# EAGLE design SparkFun_Micro_Temperature_Sensor-STTS22H (EAGLE 9.6.2)
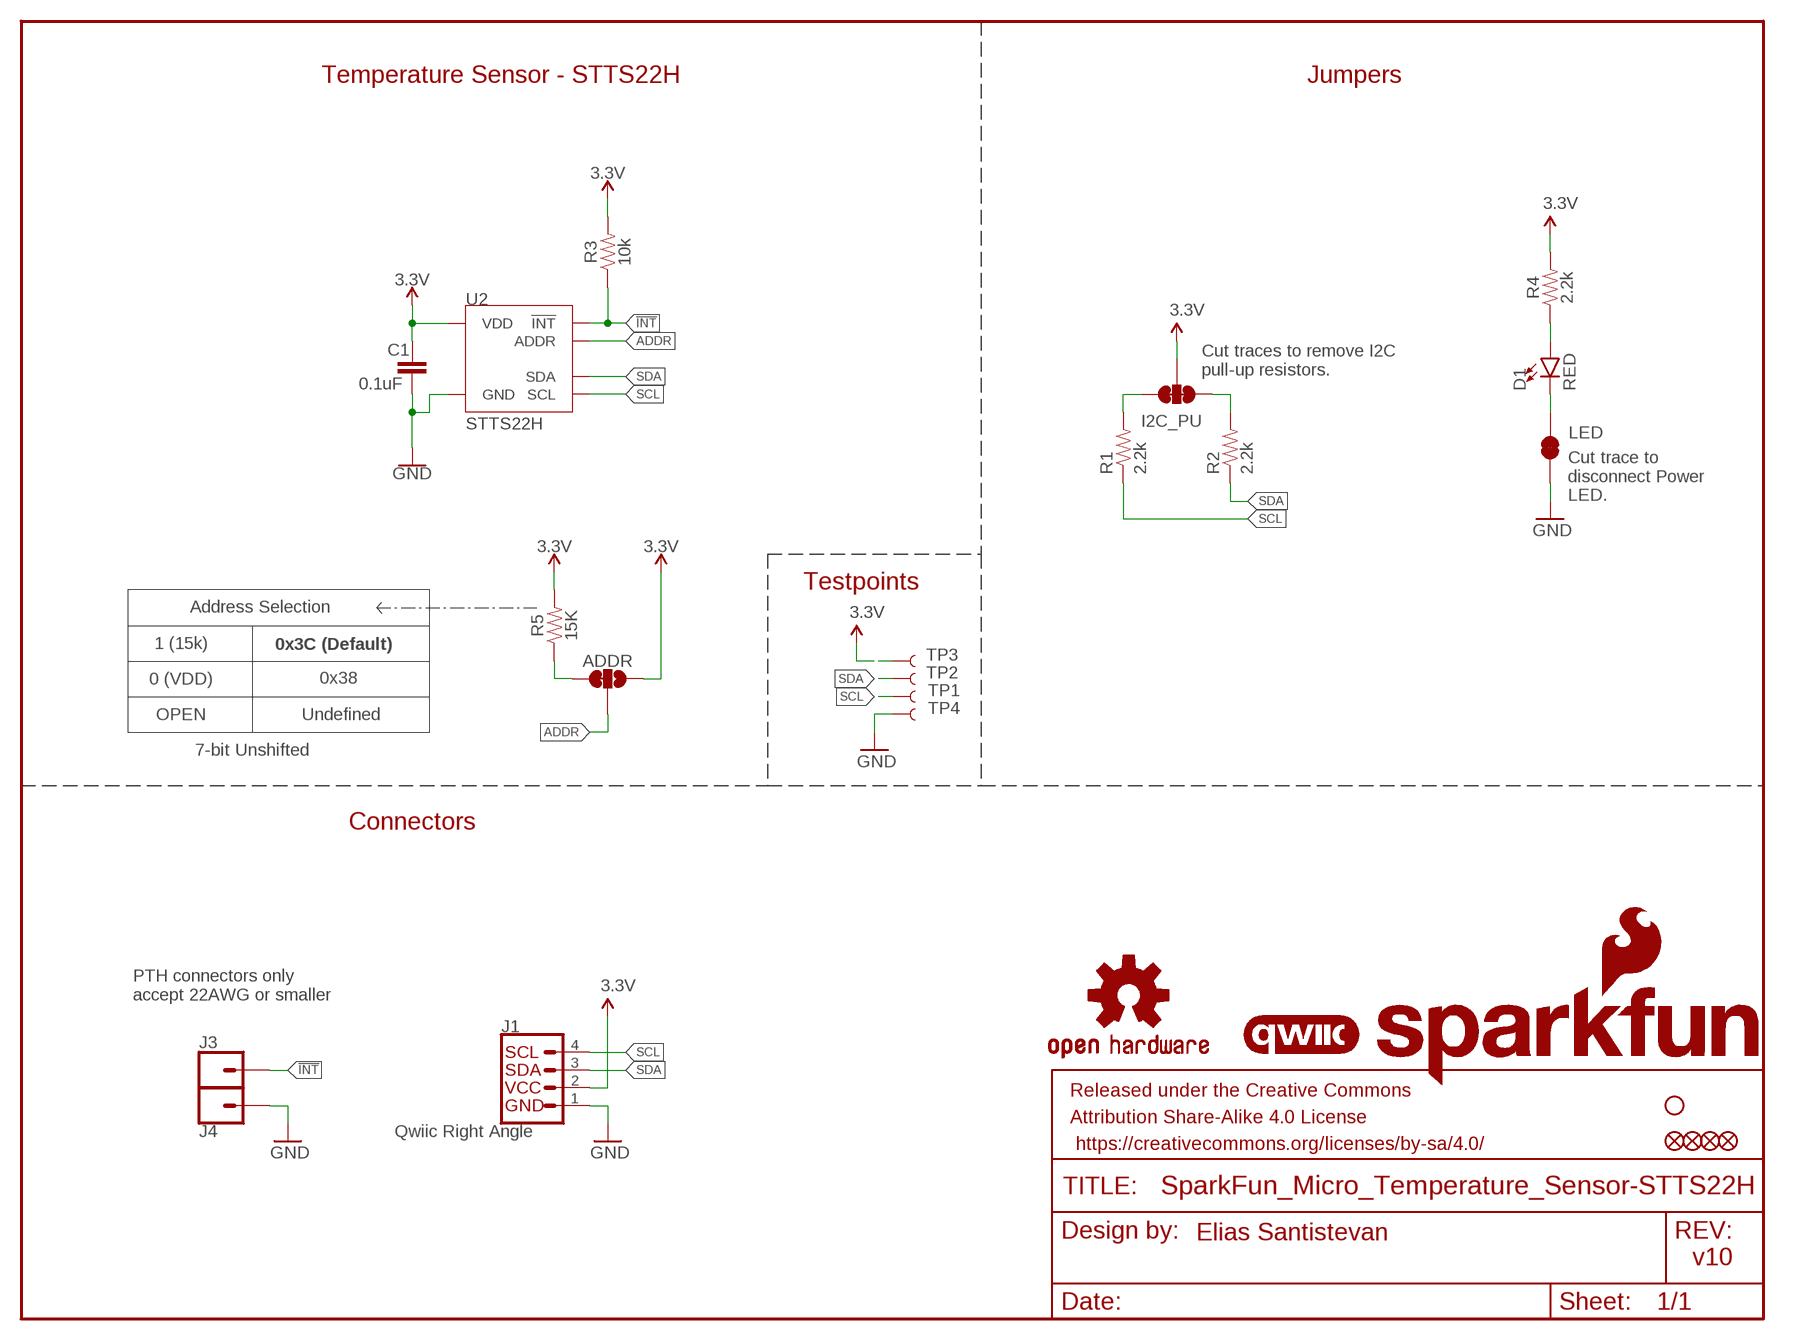
[diagram p0: schematic, sheet 1]

## Parts
ADDR  JUMPER-SMT_3_1-NC_TRACE_SILK  [SMT-JUMPER_3_1-NC_TRACE_SILK]
C1  0.1uF  0.1UF-0402T-16V-10%  [0402-TIGHT]
D1  RED  LED-RED_0402  [LED-0402]
FD1  FIDUCIALUFIDUCIAL  [FIDUCIAL-MICRO]
FD2  FIDUCIALUFIDUCIAL  [FIDUCIAL-MICRO]
FID1  FIDUCIALUFIDUCIAL  [FIDUCIAL-MICRO]
FID2  FIDUCIALUFIDUCIAL  [FIDUCIAL-MICRO]
FRAME1  FRAME-LETTER  [CREATIVE_COMMONS]
I2C_PU  S_MODE  JUMPER-SMT_3_2-NC_TRACE_SILK  [SMT-JUMPER_3_2-NC_TRACE_SILK]
J1  Qwiic Right Angle  I2C_STANDARDQWIIC  [JST04_1MM_RA]
J3  CONN_01_1MM  [1X01_1MM_NO_SILK]
J4  CONN_01_1MM  [1X01_1MM_NO_SILK]
LED  JUMPER-SMT_2_NC_TRACE_SILK  [SMT-JUMPER_2_NC_TRACE_SILK]
LOGO1  QWIIC_LOGO_3MM  [QWIIC_3MM]
LOGO2  OSHW-LOGOMINI  [OSHW-LOGO-MINI]
LOGO3  SFE_LOGO_NAME_FLAMEBLANK  [BLANK]
R1  2.2k  2.2KOHM-0402T-1/16W-1%  [0402-TIGHT]
R2  2.2k  2.2KOHM-0402T-1/16W-1%  [0402-TIGHT]
R3  10k  10KOHM-0402T-1/16W-1%  [0402-TIGHT]
R4  2.2k  2.2KOHM-0402T-1/16W-1%  [0402-TIGHT]
R5  15K  15KOHM-0402-TIGHT-1/16THW-1%  [0402-TIGHT]
STANDOFF1  STAND-OFFTIGHT  [STAND-OFF-TIGHT]
TP1  TEST-POINT3  [PAD.03X.03]
TP2  TEST-POINT3  [PAD.03X.03]
TP3  TEST-POINT3  [PAD.03X.03]
TP4  TEST-POINT3  [PAD.03X.03]
U2  STTS22H  [UDFN-6L]

## Nets
3.3V: ADDR.1 C1.1 I2C_PU.2 J1.2 R3.2 R4.2 R5.2 TP3.1 U2.P3(VDD)
!INT!: J3.1 R3.1 U2.P2(!INT!)
ADDR: ADDR.2 U2.P4(ADDR)
GND: C1.2 J1.1 J4.1 LED.1 TP4.1 U2.P5(GND) U2.P7(GND)
N$1: ADDR.3 R5.1
N$2: D1.A R4.1
N$3: D1.C LED.2
N$5: I2C_PU.1 R1.2
N$6: I2C_PU.3 R2.2
SCL: J1.4 R1.1 TP1.1 U2.P1(SCL)
SDA: J1.3 R2.1 TP2.1 U2.P6(SDA)

## Notes on the sheet
- Temperature Sensor - STTS22H | Jumpers
- Cut traces to remove I2C
  pull-up resistors.
- Cut trace to
  disconnect Power
  LED.
- Testpoints
- Address Selection
- 1 (15k)
- 0x3C (Default)
- 0 (VDD)
- 0x38
- OPEN | Undefined
- 7-bit Unshifted
- Connectors
- PTH connectors only 
  accept 22AWG or smaller
- Elias Santistevan
- v10

## Library data of the parts
ADDR = SparkFun-Jumpers:JUMPER-SMT_3_1-NC_TRACE: Normally closed trace jumper (1 of 2 connections) This jumper has a trace between two pads so it's normally closed (NC). The other connection is normally open (NO). Use a razor knife to open the connection. For best results follow the IPC guidelines for cutting traces: Cutout at least 0.063 mm (0.005 in). Remove all loose material to clean up the cut area. Seal the cut with an approved epoxy. Reapply solder to reclose the connection, or to close the NO connection.
C1 = SparkFun-Capacitors:0.1UF: 0.1µF ceramic capacitors A capacitor is a passive two-terminal electrical component used to store electrical energy temporarily in an electric field.; PROD_ID: CAP-12416
D1 = SparkFun-LED:LED-RED: Red SMD LED Used in manufacturing of most products at SparkFun Packages: 0603 - SMD 0603 package [Product Link] <http://docs.avagotech.com/docs/AV02-0551EN> 0603 SMART - SMD 0603 SMART package ( more efficient and expensive)[Product Link] <http://www.osram-os.com/Graphics/XPic2/00077099_0.pdf> 1206 - SMD1206 package [Product Link] <https://www.sparkfun.com/datasheets/DevTools/LilyPad/Q150OVS4.pdff> SparkFun Products: Pro Mini 328 -5V <https://www.sparkfun.com/products/821> RedBoard <https://www.sparkfun.com/products/12757> IOIO-OTG <https://www.sparkfun.com/products/13613>; PROD_ID: DIO-16757
FD1 FD2 FID1 FID2 = SparkFun-Aesthetics:FIDUCIAL: Fiducial Alignment Points Point-of-reference for pick-and-place machines and other optical instruments.
FRAME1 = SparkFun-Aesthetics:FRAME-LETTER: Schematic Frame - Letter Standard 8.5x11 US Letter frame; DESIGNER: Elias Santistevan
I2C_PU = SparkFun-Jumpers:JUMPER-SMT_3_2-NC_TRACE: Normally closed trace jumper (2 of 2 connections) This jumper has a trace between all three pads so they are normally closed (NC). Use a razor knife to open the connection(s). For best results follow the IPC guidelines for cutting traces: Cutout at least 0.063 mm (0.005 in). Remove all loose material to clean up the cut area. Seal the cut with an approved epoxy. Reapply solder to reclose the connection(s).
J1 = SparkFun-Connectors:I2C_STANDARD: SparkFun I2C Standard Pinout Header SparkFun has standardized on a pinout for all I2C based sensor breakouts. This pinout allows I2C boards to be plugged directly into the headers on Arduino Uno compatible boards, and to be daisy chained easily. Example SparkFun Products: SparkFun Atmospheric Sensor Breakout - BME280 <https://www.sparkfun.com/products/13676> SparkFun Altitude/Pressure Sensor Breakout - MPL3115A2 <https://www.sparkfun.com/products/11084> SparkFun TOF Range Finder Sensor - VL6180 <https://www.sparkfun.com/products/12785>; PROD_ID: CONN-13694
J3 J4 = SparkFun-Connectors:CONN_01: Single connection point. Often used as Generic Header-pin footprint for 0.1 inch spaced/style header connections On any of the 0.1 inch spaced packages, you can populate with these: Break Away Headers - Straight <https://www.sparkfun.com/products/116> (PRT-00116) Break Away Male Headers - Right Angle <https://www.sparkfun.com/products/553> (PRT-00553) Female Headers <https://www.sparkfun.com/products/115> (PRT-00115) Break Away Headers - Machine Pin <https://www.sparkfun.com/products/117> (PRT-00117) Break Away Female Headers - Swiss Machine Pin <https://www.sparkfun.com/products/743> (PRT-00743) This device is also useful as a general connection point to wire up your design to another part of your project. Our various solder wires solder well into these plated through hole pads. Hook-Up Wire - Assortment (Stranded, 22 AWG) <https://www.sparkfun.com/products/11375> (PRT-11375) Hook-Up Wire - Assortment (Solid Core, 22 AWG) <https://www.sparkfun.com/products/11367> (PRT-11367) View the entire wire category on our website here <https://www.sparkfun.com/categories/141> Special notes: SMTSO-256-ET is a "flush mount" nut for a 4-40 screw. We mostly use this on specialty testbeds; it is a nice way to connect hardware to your PCB at an adjustable hieght. Also note, the SNAP packages are for using a snappable style connector. We sell a baggie of snaps and they are also used on two LilyPad designs: Snap Assortment - 30 pack (male and female) <https://www.sparkfun.com/products/11347> (DEV-11347) LilyPad Arduino SimpleSnap <https://www.sparkfun.com/products/10941> (DEV-10941) LilyPad SimpleSnap Protoboard <https://www.sparkfun.com/products/10940> (DEV-10940)
LED = SparkFun-Jumpers:JUMPER-SMT_2_NC_TRACE: Normally closed trace jumper This jumper has a trace between two pads so it's normally closed (NC). Use a razor knife to open the connection. For best results follow the IPC guidelines for cutting traces: Cutout at least 0.063 mm (0.005 in). Remove all loose material to clean up the cut area. Seal the cut with an approved epoxy. Reapply solder to reclose the connection.
LOGO1 = SparkFun-Aesthetics:QWIIC_LOGO: Qwiic Logos for placement on schematic and PCB. The 5.5mm silk logo is best for placing next to Qwiic connector.
LOGO2 = SparkFun-Aesthetics:OSHW-LOGO: Open-Source Hardware (OSHW) Logo This logo indicates the piece of hardware it is found on incorporates a OSHW license and/or adheres to the definition of open source hardware found here: http://freedomdefined.org/OSHW
LOGO3 = SparkFun-Aesthetics:SFE_LOGO_NAME_FLAME: SparkFun Font Logo w/ Flame This is the SparkFun full logo. The logo on the schematic will always be the same size; the package variant is the height of the flame part of the logo. Default layer for the logo on the board is tSilk.
R1 R2 R4 = SparkFun-Resistors:2.2KOHM: 2.2kΩ resistor A resistor is a passive two-terminal electrical component that implements electrical resistance as a circuit element. Resistors act to reduce current flow, and, at the same time, act to lower voltage levels within circuits. - Wikipedia; PROD_ID: RES-14341
R3 = SparkFun-Resistors:10KOHM: 10kΩ resistor A resistor is a passive two-terminal electrical component that implements electrical resistance as a circuit element. Resistors act to reduce current flow, and, at the same time, act to lower voltage levels within circuits. - Wikipedia; PROD_ID: RES-14241
R5 = SparkFun-Resistors:15KOHM: 15kΩ resistor A resistor is a passive two-terminal electrical component that implements electrical resistance as a circuit element. Resistors act to reduce current flow, and, at the same time, act to lower voltage levels within circuits. - Wikipedia; PROD_ID: RES-15004
STANDOFF1 = SparkFun-Hardware:STAND-OFF: Stand Off Drill holes for mechanically mounting via screws, standoffs, etc. Note: Use the keepout ring to avoid running the screw head into surrounding components. Variant Overviews STAND-OFF - Mechanical footprint for a #4 phillips button head screw. STAND-OFF-TIGHT - Mechanical footprint for a #4 phillips button head screw, Example SparkFun Products Screw - Phillips Head (1/4", 4-40, 10 pack) <https://www.sparkfun.com/products/10453> (PRT-10453) Screw - Phillips Head (1/2", 4-40, 10 pack) <https://www.sparkfun.com/products/10452> (PRT-10452) Screw - Phillips Head (3/4", 4-40, 10 pack) <https://www.sparkfun.com/products/10451> (PRT-10451) Screw - Phillips Head (1", 4-40, 10 pack) <https://www.sparkfun.com/products/10450> (PRT-10450)
TP1-TP4 = SparkFun-Connectors:TEST-POINT: SparkFun Test Points Bare copper test points for troubleshooting or In-Circuit-Testing. These are used by our Production team for verifying production board runs using pogo-pins on test beds. SparkFun Products: SparkFun LSM9DS1 Breakout <https://www.sparkfun.com/products/13284> SparkFun PSOC <https://www.sparkfun.com/products/13714> SparkFun Load Cell Amplifier <https://www.sparkfun.com/products/13879>
U2 = STTS22H:STTS22H: STMicroelectronics STTS22H Temperature Sensor The STTS22H is a digital temperature sensor that communicates over a 2-wire I²C/SMBus 3.0 serial interface. Thanks to its factory calibration, the STTS22H offers high-end accuracy performance over the entire operating temperature range reaching as low as ±0.5 °C without requiring any further calibration at the application level. Datasheet <https://www.st.com/en/mems-and-sensors/stts22h.html#documentation>; PROD_ID: IC-17235

## Board
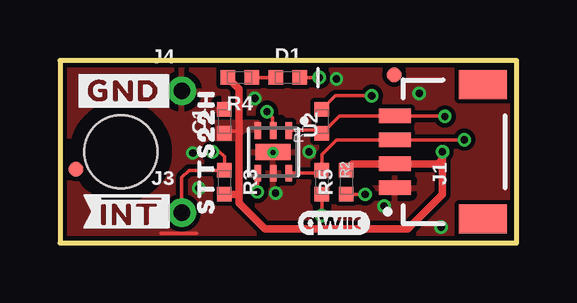
[diagram p1: board, top side]
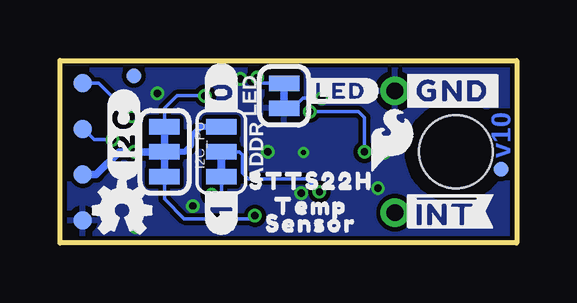
[diagram p2: board, bottom side, seen from below]

Size 19.05 x 7.62 mm. Coordinates in mm from the lower left corner, seen from the top.
Outline: 19.05,7.62 0,7.62 0,0 19.05,0 19.05,7.62
Copper layers (1*16): Top 0.035mm / dielectric 1.5mm / Bottom 0.035mm
Design rules "SparkFun-2-Layer-Minimum-JLCPCB": minimum track width 5mil, minimum drill 0.3mm, track to track 5mil, track to pad 5mil, pad to pad 5mil, via to via 5mil, smd to smd 5mil, copper to edge 7mil, drill to drill 7mil, minimum pad ring 5mil, minimum via ring 5mil, stop-mask expansion 2.5mil, vias tented up to drill 25mil, thermal gap 10mil
tRestrict: area 9.2,5 to 9.2,5.2

### Footprints (pad centres in the part's own frame; a part is rotated, then mirrored left to right if it is on the bottom)
SMT-JUMPER_3_1-NC_TRACE_SILK = smd 0.66 x 1.27: 1 -1.041,0; 2 0,0; 3 1.041,0
0402-TIGHT = smd 0.6 x 0.6: 1 -0.5,0; 2 0.5,0
LED-0402 = smd 0.6 x 0.6: A -0.5,0; C 0.5,0
FIDUCIAL-MICRO = smd 0.635 x 0.635: 1 0,0
SMT-JUMPER_3_2-NC_TRACE_SILK = smd 0.66 x 1.27: 1 -1.041,0; 2 0,0; 3 1.041,0
JST04_1MM_RA = smd 0.6 x 1.35: 1 -1.5,0; 2 -0.5,0; 3 0.5,0; 4 1.5,0 | smd 1.2 x 2: NC1 2.8,-3.675; NC2 -2.8,-3.675
1X01_1MM_NO_SILK = drill 0.7 pad 1.2: 1 0,0
SMT-JUMPER_2_NC_TRACE_SILK = smd 0.66 x 1.27: 1 -0.521,0; 2 0.521,0
STAND-OFF-TIGHT = hole 3.048: 0,0
PAD.03X.03 = smd 0.762 x 0.762: 1 0,0
UDFN-6L = smd 0.7 x 0.27: P1 -0.89,0.65; P2 -0.89,0; P3 -0.89,-0.65; P4 0.89,-0.65; P5 0.89,0; P6 0.89,0.65 | smd 0.65 x 1.45: P7 0.01,0

### Placement (x,y rotation side)
ADDR  12.32,3.81 270 bottom
C1  6.86,5.08 90 top
D1  9.5,6.91 0 top
FD1  15.98,6.99 0 bottom
FD2  0.66,3.07 0 bottom
FID1  13.94,7.01 0 top
FID2  0.66,3.07 0 top
FRAME1  -20.32,-19.05 0 top  (outside the outline)
I2C_PU  14.69,3.81 270 bottom
J1  13.97,3.81 90 top
J3  5.08,1.27 0 top
J4  5.08,6.35 0 top
LED  9.7,6.15 90 bottom
LOGO1  11.43,0.84 0 top
LOGO2  16.46,1.38 0 bottom
LOGO3  -39.37,-15.24 0 top  (outside the outline)
R1  10.92,5.08 90 top
R2  10.92,2.54 270 top
R3  6.86,2.54 270 top
R4  7.49,6.91 180 top
R5  11.94,2.54 90 top
STANDOFF1  2.54,3.81 0 top
TP1  18.1,6.67 270 bottom
TP2  18.1,4.76 0 bottom
TP3  18.1,2.86 0 bottom
TP4  18.1,0.95 0 bottom
U2  8.89,3.81 270 top
U$1  [#0#4]  12.32,6.35 90 bottom
U$2  [#1#4]  12.32,1.37 90 bottom
U$3  [#LED#2121]  7.34,6.35 0 bottom
U$4  [#GND#4]  2.67,6.35 0 top
U$5  [##INT##9]  2.95,1.32 0 top
U$6  [##INT##9]  2.95,1.32 0 bottom
U$7  [STTS22H11]  6.1,3.81 90 top
U$8  [STTS22H11]  8.59,2.59 0 bottom
U$9  [TEMP24]  8.59,1.55 0 bottom
U$10  [#GND#4]  2.67,6.35 0 bottom
U$11  [SENSOR25]  8.59,0.81 0 bottom
U$12  [#I2C#4]  16.38,4.52 90 bottom
U$29  [SFE_LOGO_FLAME_.1]  5.21,4.32 0 bottom

### Tracks (layer width: path | path; a pad name or v marks a point on that pad's centre or on a via)
3.3V  (via drill 0.3)
  Top 0.152: C1.1 6.95,4.67 7.47,4.67
  Top 0.305: R4.2 7.47,6.43 7.47,4.67 7.47,2.03 | 15.76,3.31 J1.2 12.21,3.31 R5.2 | v15.95,3.81 15.95,3.5 | 15.95,3.5 15.95,3.15 | 15.95,3.15 15.95,2.03 14.5,0.58 8.56,0.58 7.47,1.68 7.47,2.03 | R3.2 7.46,2.04 7.47,2.03 | 15.95,3.5 15.76,3.31 | 15.76,3.31 15.92,3.15 15.95,3.15
  Bottom 0.254: ADDR.1 13.18,4.85 13.59,4.45 13.59,4.06 13.84,3.81 I2C_PU.2
  Bottom 0.305: I2C_PU.2 v15.95,3.81 16.58,3.81 17.54,2.86 TP3.1
  pour Top (no thermals): 8.28,4.67 8.28,5.08 6.5,5.08 6.5,4.32 7.37,4.32 7.72,4.67
!INT!  (via drill 0.3)
  Top 0.152: v8.64,5.49 8.87,5.25 8.87,4.72 U2.P2 | v6.35,3.81 6.66,3.81 6.86,3.61 R3.1 5.38,3.04 5.08,2.74 J3.1
  Bottom 0.152: v6.35,3.81 6.35,5.23 6.6,5.49 v8.64,5.49
ADDR  (via drill 0.3)
  Top 0.152: U2.P4 8.24,2.14 v8.23,2.13
  Bottom 0.152: v8.23,2.13 8.76,2.67 11.18,2.67 11.43,2.92 11.43,3.68 11.56,3.81 ADDR.2
GND  (via drill 0.2, 0.3)
  Top 0.152: 4.22,0.41 5.69,0.41
  Bottom 0.152: LED.1 9.33,5.63 8.91,6.04 v8.13,6.04
  other vias: 13.51,1.55 5.54,3.76 8.99,2.08 11.53,6.86 5.79,2.29 15.9,0.66 14.99,6.25 10.39,3.81 8.89,3.78
  pour Bottom (isolate 0.178): 19.05,0 19.05,7.62 0,7.62 0,0
  pour Top (isolate 0.178, rank 2): 19.05,0 19.05,7.62 0,7.62 0,0
N$1  (via drill 0.3)
  Top 0.152: v12.72,2.03 12.72,2.04 R5.1
  Bottom 0.152: v12.72,2.03 12.39,2.03 12.32,2.11 ADDR.3
N$2
  Top 0.152: R4.1 D1.A
N$3  (via drill 0.3)
  Top 0.152: D1.C v10.82,6.91
  Bottom 0.152: v10.82,6.91 10.58,6.67 LED.2
N$5  (via drill 0.3)
  Top 0.152: v13.01,6.15 11.49,6.15 R1.2
  Bottom 0.152: v13.01,6.15 14.17,6.15 14.69,5.63 I2C_PU.1
N$6  (via drill 0.3)
  Top 0.152: R2.2 v10.92,1.14
  Bottom 0.152: I2C_PU.3 14.69,1.83 13.87,1.02 11.05,1.02 v10.92,1.14
SCL  (via drill 0.3)
  Top 0.152: v16.05,5.28 16.03,5.31 J1.4 11.65,5.31 R1.1 10.78,4.73 9.57,4.73 U2.P1
  Bottom 0.152: TP1.1 17.44,6.67 v16.05,5.28
SDA  (via drill 0.3)
  Top 0.152: v16.87,4.32 16.86,4.31 J1.3 11.54,4.31 10.92,3.69 R2.1 10.8,2.92 U2.P6
  Bottom 0.152: v16.87,4.32 17.63,4.32 18.07,4.76 TP2.1

### Text on the board
Bottom: v10
Measures: Units in Inches